# Altium schematic sheet Power,Sensors.SchDoc: AA Design Challenge
size 431 x 279 mm; Revision: 1.0; SheetNumber: 4; SheetTotal: 4; ProjectName: TRK_GPRS_GNSS_BTLE
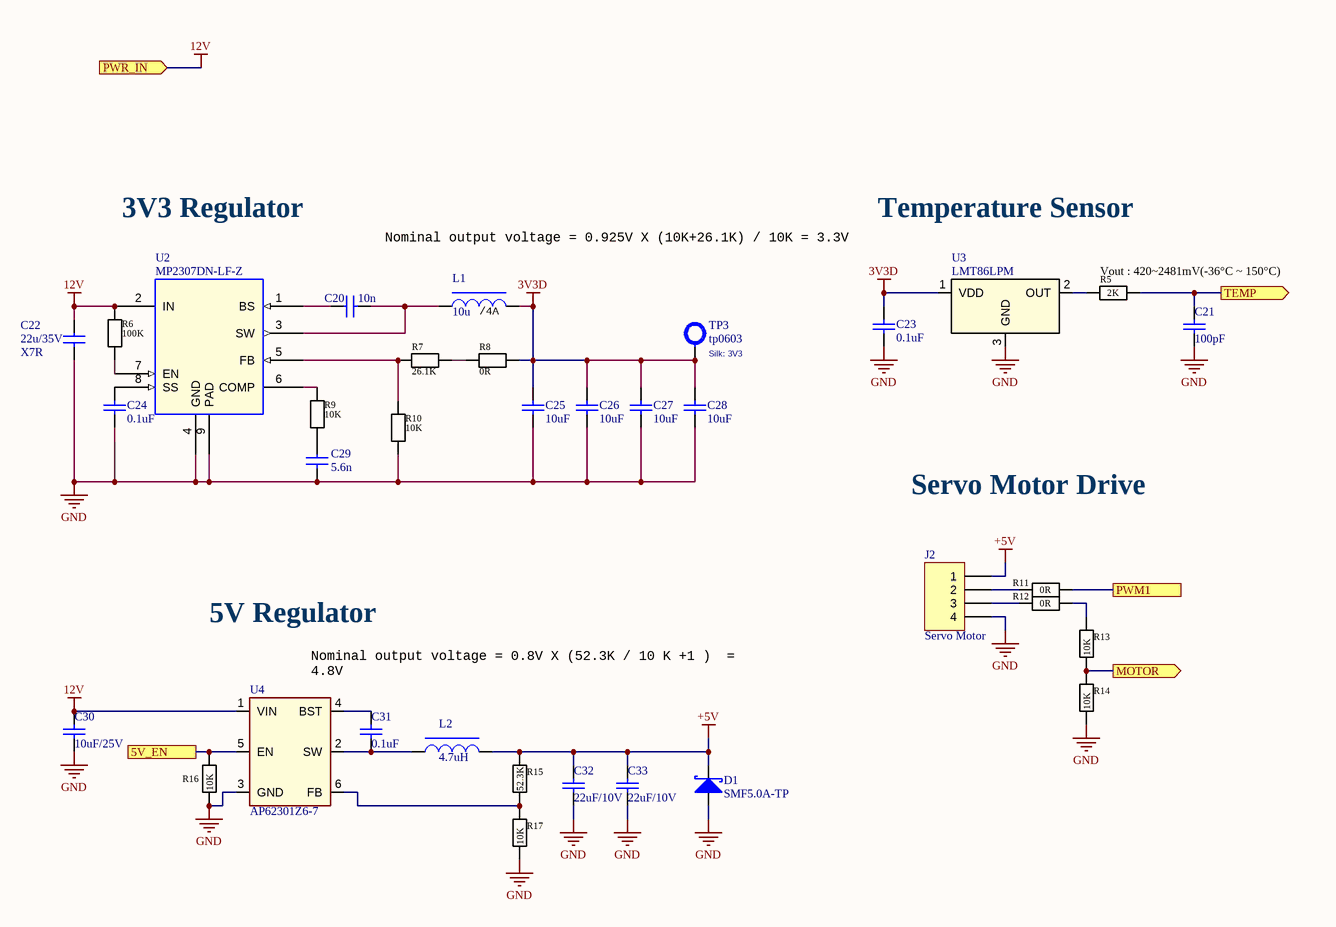
[diagram p0: Power,Sensors.SchDoc]

## Parts
C20  10n  [CAPC1005X55USR]
C21  100pF  [CAPC1005X61USR]
C22  22u/35V  material: X7R  [CAPC3216X175USR]
C23  0.1uF  [CAPC1005X61USR]
C24  0.1uF  [CAPC1005X61USR]
C25  10uF  [CAPC1005X61USR]
C26  10uF  [CAPC1005X61USR]
C27  10uF  [CAPC1005X61USR]
C28  10uF  [CAPC1005X61USR]
C29  5.6n  [CAPC1005X55USR]
C30  10uF/25V  [CAPC2012X145USR]
C31  0.1uF  [CAPC1005X61USR]
C32  22uF/10V  [CAPC2012X145USR]
C33  22uF/10V  [CAPC2012X145USR]
D1  SMF5.0A-TP  [SOD123FL]
J2  Servo Motor  [4 pin 2.54 mm Breakaway]  (no BOM)
L1  10u  [IND_0630CDMCCDS_SUM]
L2  4.7uH  [IND_NR5040]
R5  2K  [RESC1005X40USR]
R6  100K  [RESC1005X40USR]
R7  26.1K  [RESC1005X40USR]
R8  0R  [RESC1005X40USR]
R9  10K  [RESC1005X40USR]
R10  10K  [RESC1005X40USR]
R11  0R  [RESC1005X40USR]
R12  0R  [RESC1005X40USR]
R13  10K  [RESC1005X40USR]
R14  10K  [RESC1005X40USR]
R15  52.3K  [RESC1005X40USR]
R16  10K  [RESC1005X40USR]
R17  10K  [RESC1005X40USR]
TP3  tp0603  Silk: 3V3  [TP 1mm]
U2  MP2307DN-LF-Z  [SOIC127P600X175-9N]
U3  LMT86LPM  [LP3_TEX]
U4  AP62301Z6-7  [SOT563]

## Ports
5V_EN, MOTOR (out), PWM1, PWR_IN (in), TEMP (out)

## Nets
3V3D: C23.1 C25.1 C26.1 C27.1 C28.1 L1.2 R8.2 TP3.1 U3.1(VDD)
12V: C22.1 C30.1 R6.1 U2.2(IN) U4.1(VIN) ; port PWR_IN
+5V: C32.1 C33.1 D1.C J2.1 L2.2 R15.2
GND: C21.1 C22.2 C23.2 C24.2 C25.2 C26.2 C27.2 C28.2 C29.2 C30.2 C32.2 C33.2 D1.A J2.4 R10.2 R14.1 R16.1 R17.1 U2.4(GND) U2.9(PAD) U3.3(GND) U4.3(GND)
5V_EN: R16.2 U4.5(EN) ; port 5V_EN
MOTOR: R13.1 R14.2 ; port MOTOR
PWM1: R11.2 ; port PWM1
TEMP: C21.2 R5.2 ; port TEMP
NetC20_1: C20.1 U2.1(BS)
NetC20_2: C20.2 L1.1 U2.3(SW)
NetC24_1: C24.1 U2.8(SS)
NetC29_1: C29.1 R9.2
NetC31_1: C31.1 U4.4(BST)
NetC31_2: C31.2 L2.1 U4.2(SW)
NetJ2_2: J2.2 R11.1
NetJ2_3: J2.3 R12.1
NetR5_1: R5.1 U3.2(OUT)
NetR6_2: R6.2 U2.7(EN)
NetR7_1: R7.1 R10.1 U2.5(FB)
NetR7_2: R7.2 R8.1
NetR9_1: R9.1 U2.6(COMP)
NetR12_2: R12.2 R13.2
NetR15_1: R15.1 R17.2 U4.6(FB)

## Notes on the sheet
- 3V3 Regulator
- Nominal output voltage = 0.925V X (10K+26.1K) / 10K = 3.3V
- Temperature Sensor
- (near L1) /4A
- (near R5) Vout : 420~2481mV(-36°C ~ 150°C)
- Servo Motor Drive
- 5V Regulator
- Nominal output voltage = 0.8V X (52.3K / 10 K +1 )  = 4.8V
- DWG. NO.
- REV.
- SHT.
- THIS DOCUMENT AND THE DATA DISCLOSED HEREIN OR HEREWITH IS THE PROPERTY OF ALTIUM LIMITED AND MAY BE FREELY DISTRIBUTED IN WHOLE. NO RIGHTS ARE RESERVED OR EXPRESS OR IMPLIED WARANTEE GIVEN.
- REVISION
- DESCRIPTION
- DATE
- APPROVED
- ENG:
- APPROVALS
- PROJECT
- DSN:
- CHK:
- REFERENCE DOCUMENTS
- PROJECT REVISION:
- TITLE
- DOCUMENT REVISION:
- DESIGN ITEM:
- BOM:
- FAB DWG:
- PCB DWG:
- ASSY DWG:
- SCALE:
- SIZE
- B
- CAGE CODE
- FILE NAME
- DWG NO.
- SHEET
- OF
- REV

## Library data of the parts
C20 = capacitor: CAP CER 10000PF 25V X7R 0402; Manufacturer: Murata Electronics; Manufacturer Product Number: GRM155R71E103JA01J; value_fp: 0; Max_Power: W; Device_class: DISCRETE; PCB Footprint: 0402; Digi-Key Part Number: 490-6340-2-ND; Part Type: C; Signal_model: capacitor
C21 = Cap: CAP CER 100PF 50V C0G/NP0 0402; Manufacturer: Murata Electronics; Manufacturer Part Number: GCM1555C1H101FA16D; Supplier Part Number 1: 490-14349-2-ND; Supplier Part Number 2: *; Supplier 1: *; Supplier 2: *; 100pc cost: *; 1pc cost: *; Height: *; value: 100pF
C22 = capacitor: CAP CER 22UF 35V JB 1206; Manufacturer Part Number: C3216JB1V226M160AC; Manufacturer: TDK Corporation; PCB Footprint: 1206; Supplier Part Number 1: 445-11739-2-ND; Part Type: C; Supplier 1: Digi-Key
C23 C24 C31 = Cap: CAP CER 0.1UF 50V X7R 0402; Manufacturer: TDK Corporation; Manufacturer Part Number: CGA2B3X7R1H104K050BB; Supplier Part Number 1: 445-6899-2-ND; Supplier Part Number 2: *; Supplier 1: *; Supplier 2: *; 100pc cost: *; 1pc cost: *; Height: *; value: 0.1uF
C25-C28 = Cap: CAP CER 10UF 10V X5R 0402; Manufacturer: Samsung Electro-Mechanics; Manufacturer Part Number: CL05A106MP8NUB8; Supplier Part Number 1: 1276-6830-2-ND; Supplier Part Number 2: *; Supplier 1: *; Supplier 2: *; 100pc cost: *; 1pc cost: *; Height: *; value: 10uF
C29 = capacitor: CAP CER 5600PF 50V X7R 0402; Manufacturer: Murata Electronics; Manufacturer Product Number: GRM155R71H562KA88D; value_fp: 0; Max_Power: W; tolerance: 10%; ALT_SYMBOL: 0603_wave; Device_class: DISCRETE; PCB Footprint: 0402; Digi-Key Part Number: 490-6364-2-ND; Part Type: C; Signal_model: capacitor
C30 = Cap: CAP CER 10UF 25V X5R 0805; Manufacturer: TDK Corporation; Manufacturer Part Number: C2012X5R1E106K125AB; Supplier Part Number 1: 445-5984-2-ND; Supplier Part Number 2: *; Supplier 1: *; Supplier 2: *; 100pc cost: *; 1pc cost: *; Height: *; value: 10uF/25V
C32 C33 = Cap: CAP CER 22UF 10V X5R 0805; Manufacturer: Samsung; Manufacturer Part Number: CL21A226KPCLRNC; Supplier Part Number 1: 1276-6786-2-ND; Supplier Part Number 2: *; Supplier 1: *; Supplier 2: *; 100pc cost: *; 1pc cost: *; Height: *; value: 22uF/10V
D1 = SMF5.0A-TP: TVS DIODE 5VWM 9.2VC SOD123FL; Manufacturer: Micro Commercial Co; Trr (ns): 5; ComponentLink2URL: http://www.nxp.com/documents/data_sheet/BAT54_SER.pdf; Manufacturer Part Number: SMF5.0A-TP; ComponentLink2Description: Datasheet; PackageReference: SOT123FL; Mounting Technology: Surface Mount; ComponentLink1URL: http://www.nxp.com/; ComponentLink1Description: Manufacturer URL; Supplier Part Number 1: SMF5.0A-TPMSTR-ND; Supplier 1: Digi-Key
J2 = Header 4: Header, 4-Pin
L1 = inductor: FIXED IND 10UH 4A 67 MOHM SMD; Manufacturer: Sumida America Components Inc.; Manufacturer Part Number: 0630CDMCCDS-100MC; Device_class: DISCRETE; Voltage: V; tolerance: 20%; Max_Power: 4W; Digi-Key Part Number: 308-2459-2-ND; Part Type: L
L2 = inductor: FIXED IND 4.7UH 3.1A 37.7MOHM SM; Manufacturer: Taiyo Yuden; Manufacturer Part Number: NR5040T4R7N; Digi-Key Part Number: 587-2373-2-ND; Part Number: NR5040T4R7N
R5 = R: RES SMD 2K OHM 1% 1/16W 0402; Manufacturer: Yageo; Manufacturer Part Number: RC0402FR-072KL; Power Rating: 62.5mW; Tolerance: +/-1%; Voltage Rating: NA; Distributor: DigiKey; Value: 2K; Distributor Art. Nbr.: 311-2KLRTR-ND; Package: EIA-0402; Price Estim. @ 100pcs: 0.0049; Height: 0.40mm
R6 = R: RES SMD 100K OHM 1% 1/16W 0402; Manufacturer: Yageo; Manufacturer Part Number: RC0402FR-07100KL; Power Rating: 62.5mW; Tolerance: +/-1%; Voltage Rating: NA; Distributor: DigiKey; Value: 100K; Distributor Art. Nbr.: 311-100KLRTR-ND; Package: EIA-0402; Price Estim. @ 100pcs: 0.0049; Height: 0.40mm
R7 = R: RES SMD 26.1K OHM 1% 1/5W 0402; Manufacturer: Vishay Dale; Manufacturer Part Number: CRCW040226K1FKEDHP; Power Rating: 62.5mW; Tolerance: +/-1%; Voltage Rating: NA; Distributor: DigiKey; Value: 26.1K; Distributor Art. Nbr.: 541-26.1KYTR-ND; Package: EIA-0402; Price Estim. @ 100pcs: 0.0049; Height: 0.40mm
R8 R11 R12 = R: RES SMD 0 OHM JUMPER 1/16W 0402; Manufacturer: Yageo; Manufacturer Part Number: RC0402FR-070RL; Power Rating: 62.5mW; Tolerance: +/-1%; Voltage Rating: NA; Distributor: DigiKey; Value: 0R; Distributor Art. Nbr.: 311-0.0LRTR-ND; Package: EIA-0402; Price Estim. @ 100pcs: 0.0049; Height: 0.40mm
R9 R10 = R: RES 10K OHM 1% 1/16W 0402; Manufacturer: Stackpole Electronics Inc; Manufacturer Part Number: RMCF0402FT10K0; Power Rating: 62.5mW; Tolerance: +/-1%; Voltage Rating: NA; Distributor: DigiKey; Value: 10K; Distributor Art. Nbr.: RMCF0402FT10K0TR-ND; Package: EIA-0402; Price Estim. @ 100pcs: 0.0049; Height: 0.40mm
R13 R14 R16 R17 = R: RES SMD 10K OHM 1% 1/16W 0402; Manufacturer: Yageo; Manufacturer Part Number: RC0402FR-0710KL; Power Rating: 62.5mW; Tolerance: +/-1%; Voltage Rating: NA; Distributor: DigiKey; Value: 10K; Package: EIA-0402; Price Estim. @ 100pcs: 0.0049; Height: 0.40mm
  R13 R14: Distributor Part Number: 311-10.0KLRTR-ND
  R16 R17: Distributor Art. Nbr.: 311-10.0KLRTR-ND
R15 = R: RES SMD 52.3K OHM 1% 1/16W 0402; Manufacturer: Yageo; Manufacturer Part Number: RC0402FR-0752K3L; Power Rating: 62.5mW; Tolerance: +/-1%; Voltage Rating: NA; Distributor: DigiKey; Value: 52.3K; Distributor Art. Nbr.: YAG3179TR-ND; Package: EIA-0402; Price Estim. @ 100pcs: 0.0049; Height: 0.40mm
TP3 = Testpkt0603: Part Number: 4001364; Mount option: Not Mounted; ALT_SYMBOL: tp0603_wave; Device_class: DISCRETE; Part Type: TP; PCB Footprint: tp0603
U2 = MP2307: IC REG BUCK ADJUSTABLE 3A 8SOIC; Manufacturer: Monolithic Power Systems Inc.; Value_fp: 0.71; PCB Footprint: so08-EDP-2; Device_class: IC; Digi-Key Part Number: 1589-1576-2-ND; Manufacturer's Part Number: MP2307DN-LF-Z; Part Number: MP2307DN-LF-Z
U3 = LMT86LPM: SENSOR ANALOG -50C-150C TO92-3; Manufacturer: Texas Instruments; SourceLibrary: TI_2019-03-25_5; Manufacturer Part Number: LMT86LPM; Digi-Key Part Number: 296-46127-1-ND; Copyright: Copyright (C) 2018 Accelerated Designs. All rights reserved; RefDes: RefDes; Type: DEV
U4 = TPS563207SDRLR: DCDC CONV HV BUCK SOT563 T&R 3K; Manufacturer: Diodes Incorporated; Geometry.Height: 0.6mm; Manufacturer Part Number: AP62301Z6-7; Digi-Key Part Number: 31-AP62301Z6-7TR-ND